# EAGLE design DA6 (EAGLE 9.3.2)
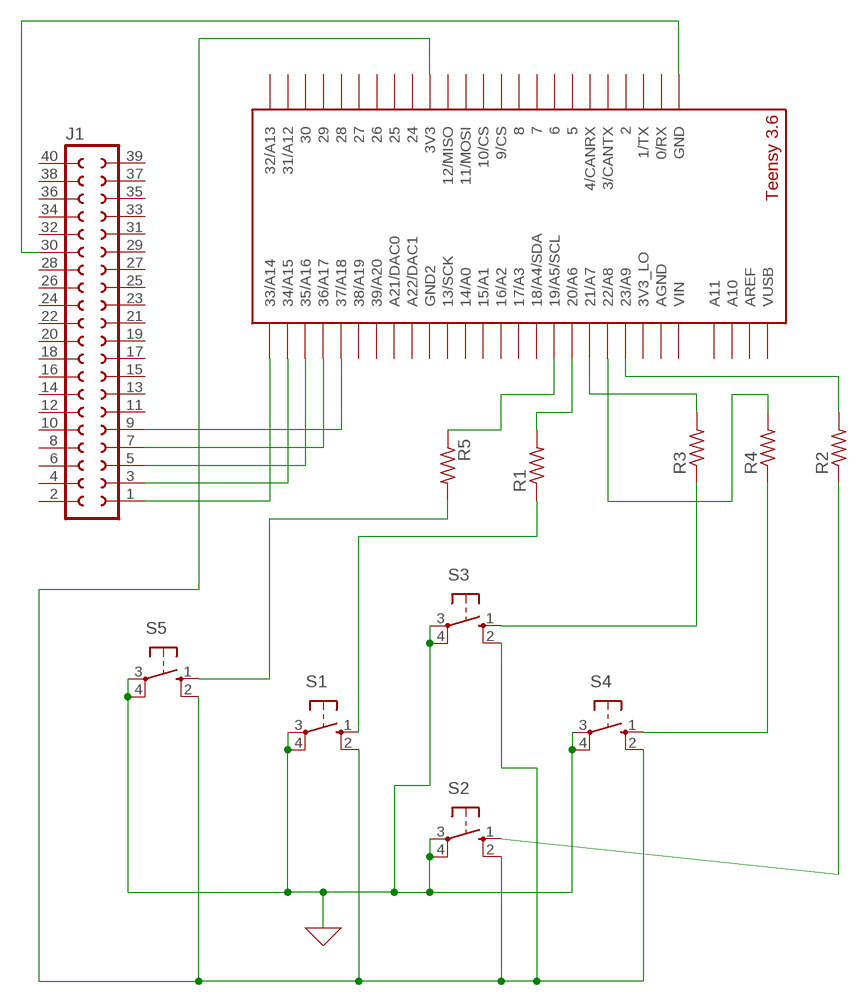
[diagram p0: schematic, sheet 1]

## Parts
J1  SOCKET-40V  [S40V]
R1  R-US_0204/2V  [0204V]
R2  R-US_0204/2V  [0204V]
R3  R-US_0204/2V  [0204V]
R4  R-US_0204/2V  [0204V]
R5  R-US_0204/2V  [0204V]
S1  10-XX  [B3F-10XX]
S2  10-XX  [B3F-10XX]
S3  10-XX  [B3F-10XX]
S4  10-XX  [B3F-10XX]
S5  10-XX  [B3F-10XX]
U$1  TEENSY_3.5/3.6_BASIC  [TEENSY_3.5/3.6_BASIC]

## Nets
0: S1.3(P) S1.4(P1) S2.3(P) S2.4(P1) S3.3(P) S3.4(P1) S4.3(P) S4.4(P1) S5.3(P) S5.4(P1) ; supply symbol labelled GND
N$1: J1.1 U$1.33/A14
N$2: J1.3 U$1.34/A15
N$3: J1.5 U$1.35/A16
N$4: J1.7 U$1.36/A17
N$5: J1.9 U$1.37/A18
N$6: S1.2(S1) S2.2(S1) S3.2(S1) S4.2(S1) S5.2(S1) U$1.3V3
N$7: J1.30 U$1.GND
N$9: R5.2 S5.1(S)
N$10: R5.1 U$1.19/A5/SCL
N$11: R1.1 S1.1(S)
N$12: R3.1 S3.1(S)
N$13: R4.1 S4.1(S)
N$14: R2.1 S2.1(S)
N$16: R1.2 U$1.20/A6
N$17: R3.2 U$1.21/A7
N$18: R4.2 U$1.22/A8
N$19: R2.2 U$1.23/A9
Unconnected: J1.2 J1.4 J1.6 J1.8 J1.10 J1.11 J1.12 J1.13 J1.14 J1.15 J1.16 J1.17 J1.18 J1.19 J1.20 J1.21 J1.22 J1.23 J1.24 J1.25 J1.26 J1.27 J1.28 J1.29 J1.31 J1.32 J1.33 J1.34 J1.35 J1.36 J1.37 J1.38 J1.39 J1.40 U$1.0/RX U$1.1/TX U$1.2 U$1.3/CANTX U$1.3V3_LO U$1.4/CANRX U$1.5 U$1.6 U$1.7 U$1.8 U$1.9/CS U$1.10/CS U$1.11/MOSI U$1.12/MISO U$1.13/SCK U$1.14/A0 U$1.15/A1 U$1.16/A2 U$1.17/A3 U$1.18/A4/SDA U$1.21/DAC0(A21/DAC0) U$1.24 U$1.25 U$1.26 U$1.27 U$1.28 U$1.29 U$1.30 U$1.31/A12 U$1.32/A13 U$1.38/A19 U$1.39/A20 U$1.A10 U$1.A11 U$1.A22/DAC1 U$1.AGND U$1.AREF U$1.GND2 U$1.VIN U$1.VUSB

## Library data of the parts
J1 = con-3m-skt-header:SOCKET-40: 40 pin PCB Socket (3m 85xx/51xx)
R1-R5 = rcl:R-US_: RESISTOR, American symbol; SPICEPREFIX: R
S1-S5 = switch-omron:10-XX: OMRON SWITCH; MPN: B3F-1000; OC_FARNELL: 176432; OC_NEWARK: 36M3542
U$1 = Teensy356:TEENSY_3.5/3.6_BASIC

## Board
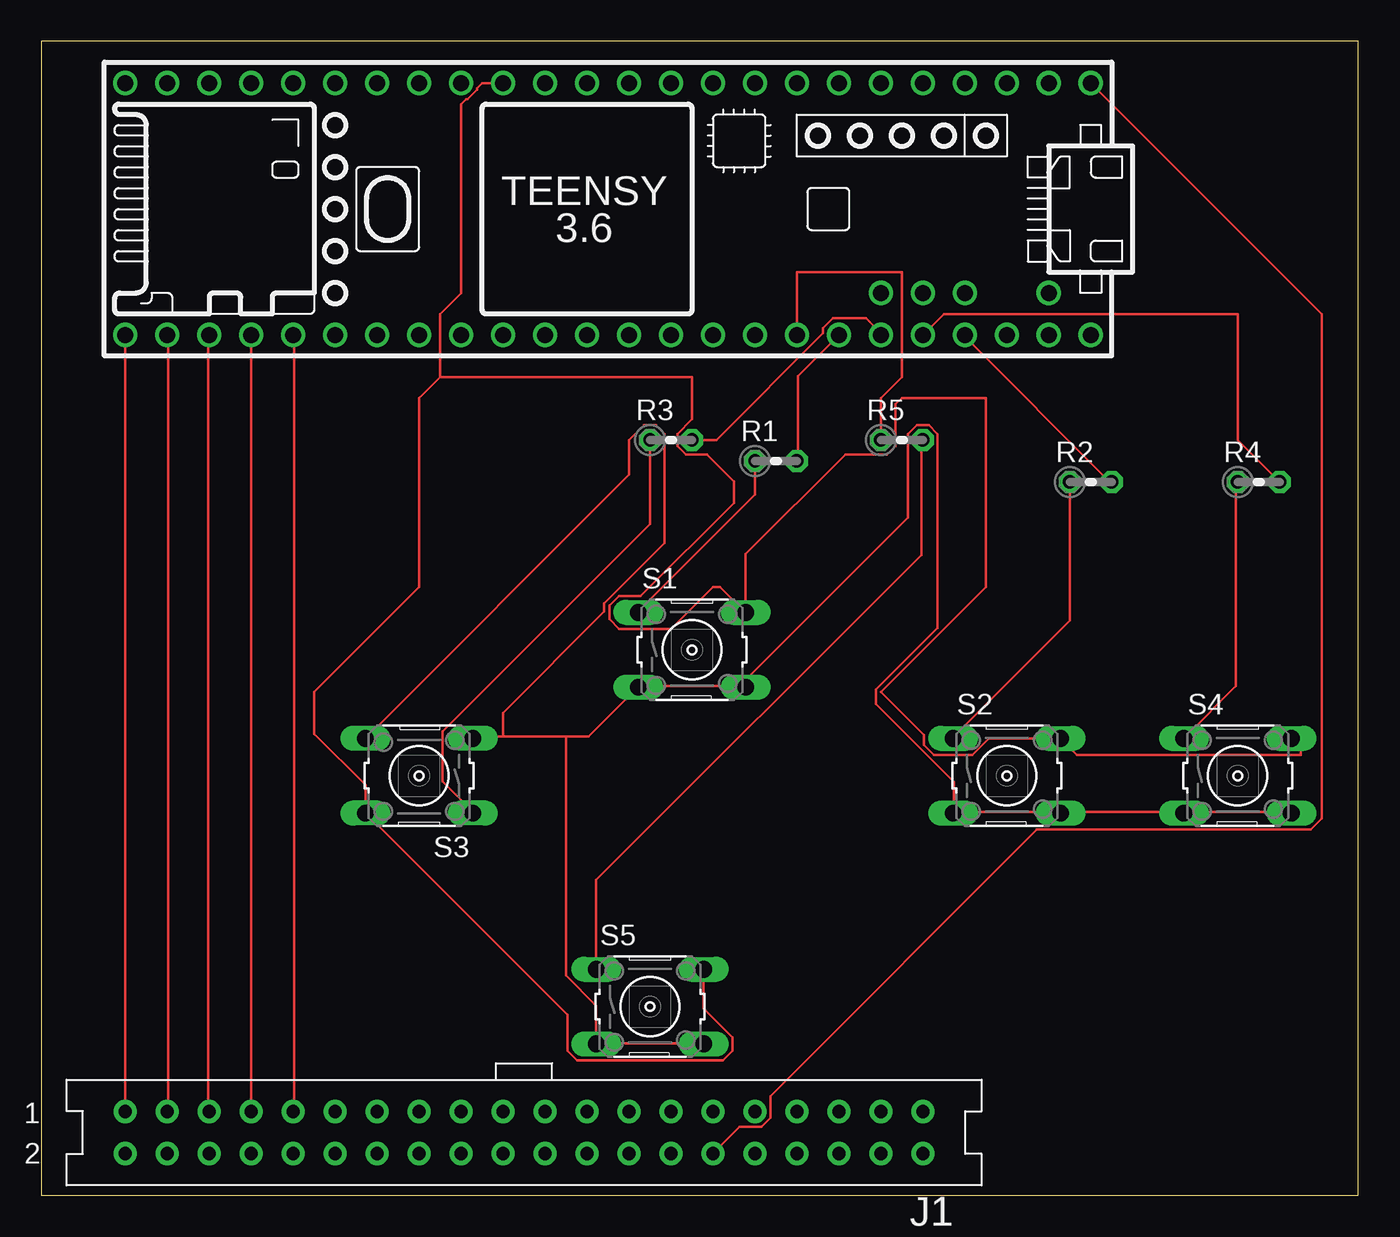
[diagram p1: board, top side]

Size 79.68 x 69.84 mm. Coordinates in mm from the lower left corner, seen from the top.
Outline: 0,0 79.68,0 79.68,69.84 0,69.84 0,0
Copper layers (1*16): Top 0.035mm / dielectric 1.5mm / Bottom 0.035mm
Design rules "default": minimum track width 6mil, minimum drill 0.35mm, track to track 6mil, track to pad 6mil, pad to pad 6mil, via to via 6mil, smd to smd 6mil, copper to edge 40mil, drill to drill 6mil, minimum pad ring 10mil, minimum via ring 8mil, stop-mask expansion 4mil, vias tented up to drill 0mil, thermal gap 10mil

### Footprints (pad centres in the part's own frame; a part is rotated, then mirrored left to right if it is on the bottom)
S40V = drill 0.8 pad 1.4: 1 24.13,-1.27; 2 24.13,1.27; 3 21.59,-1.27; 4 21.59,1.27; 5 19.05,-1.27; 6 19.05,1.27; 7 16.51,-1.27; 8 16.51,1.27; 9 13.97,-1.27; 10 13.97,1.27; 11 11.43,-1.27; 12 11.43,1.27; 13 8.89,-1.27; 14 8.89,1.27; 15 6.35,-1.27; 16 6.35,1.27; 17 3.81,-1.27; 18 3.81,1.27; 19 1.27,-1.27; 20 1.27,1.27; 21 -1.27,-1.27; 22 -1.27,1.27; 23 -3.81,-1.27; 24 -3.81,1.27; 25 -6.35,-1.27; 26 -6.35,1.27; 27 -8.89,-1.27; 28 -8.89,1.27; 29 -11.43,-1.27; 30 -11.43,1.27; 31 -13.97,-1.27; 32 -13.97,1.27; 33 -16.51,-1.27; 34 -16.51,1.27; 35 -19.05,-1.27; 36 -19.05,1.27; 37 -21.59,-1.27; 38 -21.59,1.27; 39 -24.13,-1.27; 40 -24.13,1.27
0204V = drill 0.813 octagon: 1 -1.27,0; 2 1.27,0
B3F-10XX = drill 1.016 long: 1 -3.251,2.261; 2 3.251,2.261; 3 -3.251,-2.261; 4 3.251,-2.261
TEENSY_3.5/3.6_BASIC = drill 0.965: 0/RX -25.4,-7.62; 1/TX -22.86,-7.62; 2 -20.32,-7.62; 3/CANTX -17.78,-7.62; 3V3 7.62,-7.62; 3V3_LO -22.86,7.62; 4/CANRX -15.24,-7.62; 5 -12.7,-7.62; 6 -10.16,-7.62; 7 -7.62,-7.62; 8 -5.08,-7.62; 9/CS -2.54,-7.62; 10/CS 0,-7.62; 11/MOSI 2.54,-7.62; 12/MISO 5.08,-7.62; 13/SCK 5.08,7.62; 14/A0 2.54,7.62; 15/A1 0,7.62; 16/A2 -2.54,7.62; 17/A3 -5.08,7.62; 18/A4/SDA -7.62,7.62; 19/A5/SCL -10.16,7.62; 20/A6 -12.7,7.62; 21/A7 -15.24,7.62; 21/DAC0 12.7,7.62; 22/A8 -17.78,7.62; 23/A9 -20.32,7.62; 24 10.16,-7.62; 25 12.7,-7.62; 26 15.24,-7.62; 27 17.78,-7.62; 28 20.32,-7.62; 29 22.86,-7.62; 30 25.4,-7.62; 31/A12 27.94,-7.62; 32/A13 30.48,-7.62; 33/A14 30.48,7.62; 34/A15 27.94,7.62; 35/A16 25.4,7.62; 36/A17 22.86,7.62; 37/A18 20.32,7.62; 38/A19 17.78,7.62; 39/A20 15.24,7.62; A10 -17.78,5.08; A11 -15.24,5.08; A22/DAC1 10.16,7.62; AGND -25.4,7.62; AREF -20.32,5.08; GND -27.94,-7.62; GND2 7.62,7.62; VIN -27.94,7.62; VUSB -25.4,5.08

### Placement (x,y rotation side)
J1  29.21,3.81 180 top
R1  44.45,44.45 0 top
R2  63.5,43.18 0 top
R3  38.1,45.72 0 top
R4  73.66,43.18 0 top
R5  52.07,45.72 0 top
S1  39.37,33.02 0 top
S2  58.42,25.4 0 top
S3  22.86,25.4 180 top
S4  72.39,25.4 0 top
S5  36.83,11.43 0 top
U$1  35.56,59.69 180 top

### Tracks (layer width: path | path; a pad name or v marks a point on that pad's centre or on a via)
0
  Top 0.152: 55.22,23.22 61.62,23.22 S2.4 61.77,23.22 69.09,23.22 S4.3 69.24,23.22 75.64,23.22 S4.4 | 55.22,23.22 S2.3 | 33.58,9.2 39.98,9.2 S5.4 | 31.75,27.79 33.12,27.79 36.02,30.68 S1.3 36.17,30.84 42.57,30.84 S1.4 42.62,31.19 52.45,41.02 52.45,46.09 52.97,46.61 53.71,46.61 54.23,46.09 54.23,34.34 50.5,30.61 50.5,29.74 55.22,25.02 55.22,23.22 | 31.75,27.79 27.94,27.79 | 27.94,27.79 26.11,27.79 S3.3 | 33.58,9.2 33.58,11.48 31.75,13.31 31.75,27.79 | 33.58,9.2 S5.3 | S3.4 35.56,43.61 35.56,45.71 36.46,46.61 37.2,46.61 37.72,46.09 37.72,39.47 34.06,35.82 34.06,35.33 27.94,29.21 27.94,27.79
N$1
  Top 0.152: U$1.33/A14 J1.1
N$2
  Top 0.152: J1.3 7.67,5.18 7.67,52.02 U$1.34/A15
N$3
  Top 0.152: J1.5 10.11,5.18 10.11,52.02 U$1.35/A16
N$4
  Top 0.152: U$1.36/A17 J1.7
N$5
  Top 0.152: J1.9 15.29,5.18 15.29,52.02 U$1.37/A18
N$6
  Top 0.152: U$1.3V3 26.67,67.31 26.37,67.01 26.37,66.91 25.8,66.34 25.7,66.34 25.4,66.04 25.4,54.61 24.13,53.34 24.13,49.53 | S4.2 76.2,27.1 76.2,26.67 62.66,26.67 S2.2 57.33,27.66 56.34,26.67 54,26.67 53.42,27.25 53.42,27.86 50.8,30.48 57.15,36.83 57.15,48.26 52.07,48.26 51.69,47.88 51.69,45.35 51.17,44.83 48.64,44.83 42.62,38.81 S1.2 41.07,36.83 40.64,36.83 38.1,34.29 34.95,34.29 34.37,34.87 34.37,35.69 34.95,36.27 36.27,36.27 41.91,41.91 41.91,43.19 40.27,44.83 39,44.83 38.48,45.35 38.48,46.09 39.37,46.98 39.37,49.53 24.13,49.53 | 24.13,49.53 22.86,48.26 22.86,36.83 16.51,30.48 16.51,27.94 19.61,24.84 S3.2 31.83,10.92 31.83,8.76 32.41,8.18 41.25,8.18 41.83,8.76 41.83,9.58 40.08,11.33 S5.2
N$7
  Top 0.152: U$1.GND 77.47,53.34 77.47,22.81 76.81,22.15 60.25,22.15 44.11,6.01 44.11,4.7 43.56,4.15 42.25,4.15 J1.30
N$9
  Top 0.152: S5.1 33.58,19.1 53.24,38.76 53.24,45.62 R5.2
N$10
  Top 0.152: R5.1 50.8,48.26 52.07,49.53 52.07,55.88 45.72,55.88 U$1.19/A5/SCL
N$11
  Top 0.152: R1.1 43.18,42.42 36.17,35.41 S1.1
N$12
  Top 0.152: S3.1 26.11,23.22 24.28,25.04 24.28,28.09 36.83,40.64 R3.1
N$13
  Top 0.152: R4.1 72.29,43.18 72.29,30.84 69.24,27.79 S4.1
N$14
  Top 0.152: R2.1 62.23,34.8 55.22,27.79 S2.1
N$16
  Top 0.152: U$1.20/A6 45.77,49.58 45.77,44.5 R1.2
N$17
  Top 0.152: R3.2 40.84,45.72 47.3,52.17 47.3,52.48 47.9,53.09 49.89,53.09 50.8,52.17 U$1.21/A7
N$18
  Top 0.152: R4.2 72.39,45.72 72.39,53.34 54.61,53.34 U$1.22/A8
N$19
  Top 0.152: R2.2 64.67,43.18 55.83,52.02 U$1.23/A9